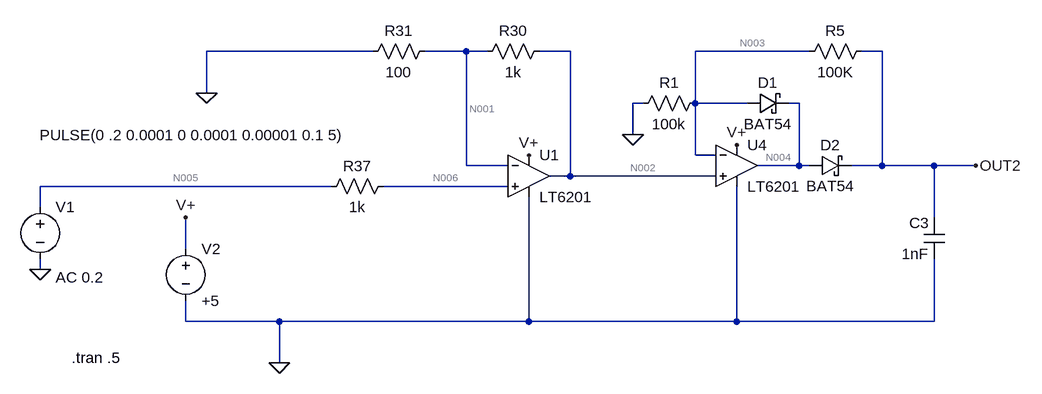
[diagram p0: schematic Muons02.asc]
* Muons02.asc
V1 N005 0 PULSE(0 .2 0.0001 0 0.0001 0.00001 0.1 5) AC 0.2
R30 N002 N001 1k
R37 N006 N005 1k
R31 N001 0 100
V2 V+ 0 +5
R5 OUT2 N003 100K
C3 0 OUT2 1nF
R1 N003 0 100k
D1 N003 N004 BAT54
D2 N004 OUT2 BAT54
* U1: LT6201 (symbol OpAmps\LT6201 not available, pins judged from their places): In+=N006 In-=N001 V+=V+ V-=0 OUT=N002
* U4: LT6201 (symbol OpAmps\LT6201 not available, pins judged from their places): In+=N002 In-=N003 V+=V+ V-=0 OUT=N004
.model D D
.lib standard.dio
.tran .5
.backanno
.end

* Results of the author's LTspice run, read from the files saved beside the schematic
* Operating Point, zero values left out:
*   V(n002) = 229.6 mV
*   V(n001) = 22.96 mV
*   V(n006) = 22.94 mV
*   V(v+) = 5 V
*   V(out2) = 219.7 mV
*   V(n003) = 229.6 mV
*   V(n004) = 92.26 mV
*   I(D2) = -99.28 nA
*   I(D1) = 20.13 µA
*   I(R1) = 2.296 µA
*   I(R5) = -99.28 nA
*   I(R31) = 229.6 µA
*   I(R37) = 22.94 µA
*   I(R30) = 206.6 µA
*   I(V2) = -28.73 mA
*   I(V1) = 22.94 µA
*   Ix(u1:1) = -22.94 µA
*   Ix(u1:2) = -22.92 µA
*   Ix(u1:3) = -184 µA
*   Ix(u1:4) = 15.53 mA
*   Ix(u1:5) = -15.3 mA
*   Ix(u4:1) = -22.59 µA
*   Ix(u4:2) = -22.53 µA
*   Ix(u4:3) = 20.23 µA
*   Ix(u4:4) = 13.2 mA
*   Ix(u4:5) = -13.17 mA
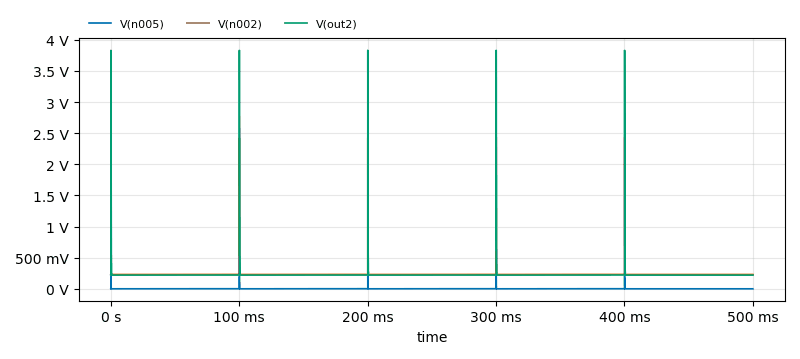
[diagram p1: Transient Analysis of Muons02.asc, plotted from the saved traces]
* Transient Analysis, 1 run:
*   V(n005): min 0 V, max 200 mV, average 121 µV, rms 4.191 mV, last 0 V
*   V(n002): min 229.6 mV, max 2.425 V, average 230.9 mV, rms 235.4 mV, last 229.6 mV
*   V(out2): min 219.7 mV, max 3.829 V, average 224.8 mV, rms 248.3 mV, last 219.7 mV